# EAGLE design audioconnect (EAGLE 6.6.0)
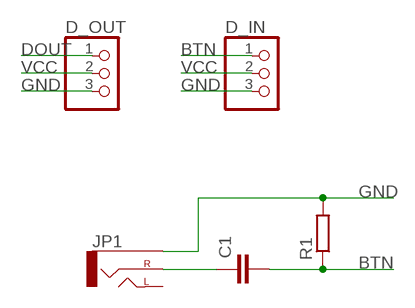
[diagram p0: schematic, sheet 1]

## Parts
C1  C-EUC1206  [C1206]
D_IN  PINHD-1X03_2.54-S  [1X03-S]
D_OUT  PINHD-1X03_2.54-S  [1X03-S]
JP1  AUDIO-JACKPTH  [AUDIO-JACK]
R1  R-EU_R1206  [R1206]

## Nets
BTN: C1.2 D_IN.1 R1.1
DOUT: D_OUT.1
GND: D_IN.3 D_OUT.3 JP1.SLEEVE R1.2
N$1: C1.1 JP1.RING(RIGHT)
VCC: D_IN.2 D_OUT.2
Unconnected: JP1.TIP(LEFT)

## Library data of the parts
C1 = resistor:C-EU: CAPACITOR, European symbol
D_IN D_OUT = pinhead-2:PINHD-1X03: PIN HEADER
JP1 = SparkFun-Connectors:AUDIO-JACK: 3.5mm Audio Jack Simple 3.5mm common PCB mount audio jack. SKU: PRT-08032
R1 = resistor:R-EU_: RESISTOR, European symbol

## Board
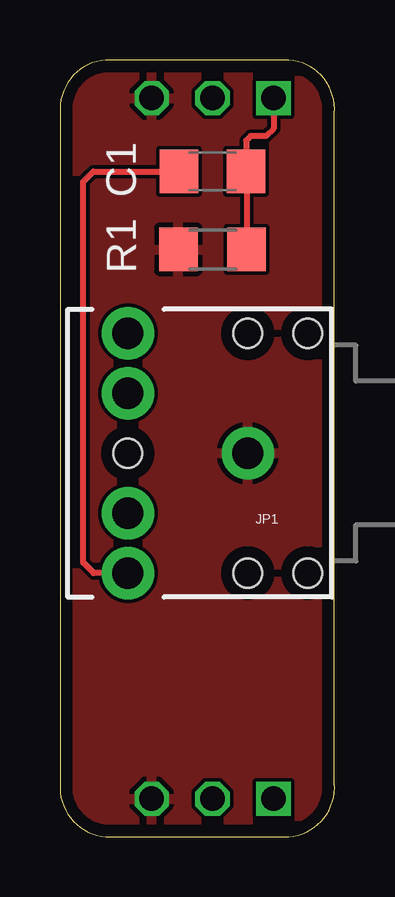
[diagram p1: board, top side]
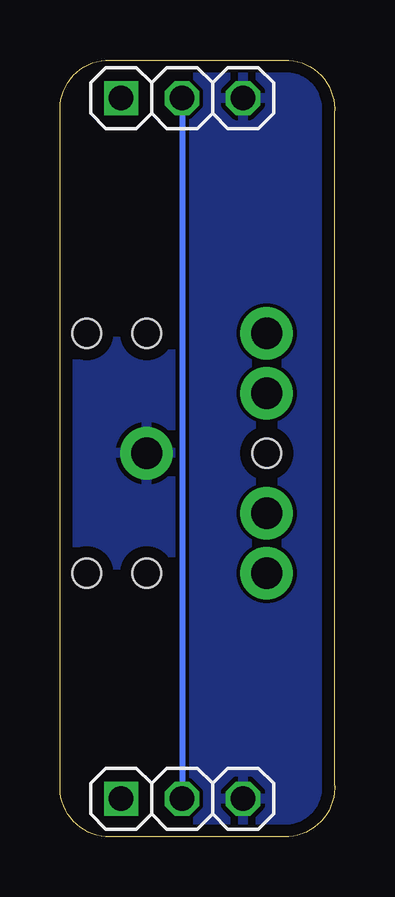
[diagram p2: board, bottom side, seen from below]

Size 11.44 x 32.38 mm. Coordinates in mm from the lower left corner, seen from the top.
Outline: 1.91,0 9.53,0 arc90 11.44,2.22 11.44,30.16 arc90 9.53,32.38 1.91,32.38 arc90 0.01,30.16 0.01,2.22 arc90 1.91,0
Copper layers (1*16): Top 0.035mm / dielectric 1.5mm / Bottom 0.035mm
Design rules "multi-cb_035um-cu": minimum track width 6mil, minimum drill 12mil, track to track 6mil, track to pad 6mil, pad to pad 6mil, via to via 6mil, smd to smd 6mil, copper to edge 20mil, drill to drill 8mil, minimum pad ring 8mil, minimum via ring 6mil, stop-mask expansion 3mil, vias tented up to drill 0mil, thermal gap 8mil

### Footprints (pad centres in the part's own frame; a part is rotated, then mirrored left to right if it is on the bottom)
C1206 = smd 1.6 x 1.8: 1 -1.4,0; 2 1.4,0
1X03-S = drill 1.016 square: 1 -2.54,0 | drill 1.016 octagon: 2 0,0; 3 2.54,0
AUDIO-JACK = drill 1.3 pad 2.184: RING 5,5; RSH 5,2.5; SLEEVE 0,0; TIP 5,-5; TSH 5,-2.5 | hole 1.2: 0,5; -2.5,5; -2.5,-5; 0,-5; 5,0
R1206 = smd 1.6 x 1.803: 1 -1.422,0; 2 1.422,0

### Placement (x,y rotation side)
C1  6.36,27.74 0 top
D_IN  6.36,30.8 0 bottom
D_OUT  6.36,1.59 0 bottom
JP1  7.83,15.99 180 top
R1  6.36,24.49 180 top

### Tracks (layer width: path | path; a pad name or v marks a point on that pad's centre or on a via)
BTN
  Top 0.254: R1.1 7.78,28.03 C1.2 7.76,29.02 7.94,29.21 8.58,29.21 8.9,29.53 D_IN.1
GND
  pour Bottom: -6.34,37.78 24.14,37.78 24.14,-7.94 -6.34,-7.94
  pour Top: -6.98,39.69 26.04,39.69 26.04,-10.48 -6.98,-10.48
N$1
  Top 0.254: JP1.RING 1.4,10.99 0.96,11.43 0.96,27.31 1.39,27.74 C1.1
VCC
  Bottom 0.254: D_IN.2 D_OUT.2